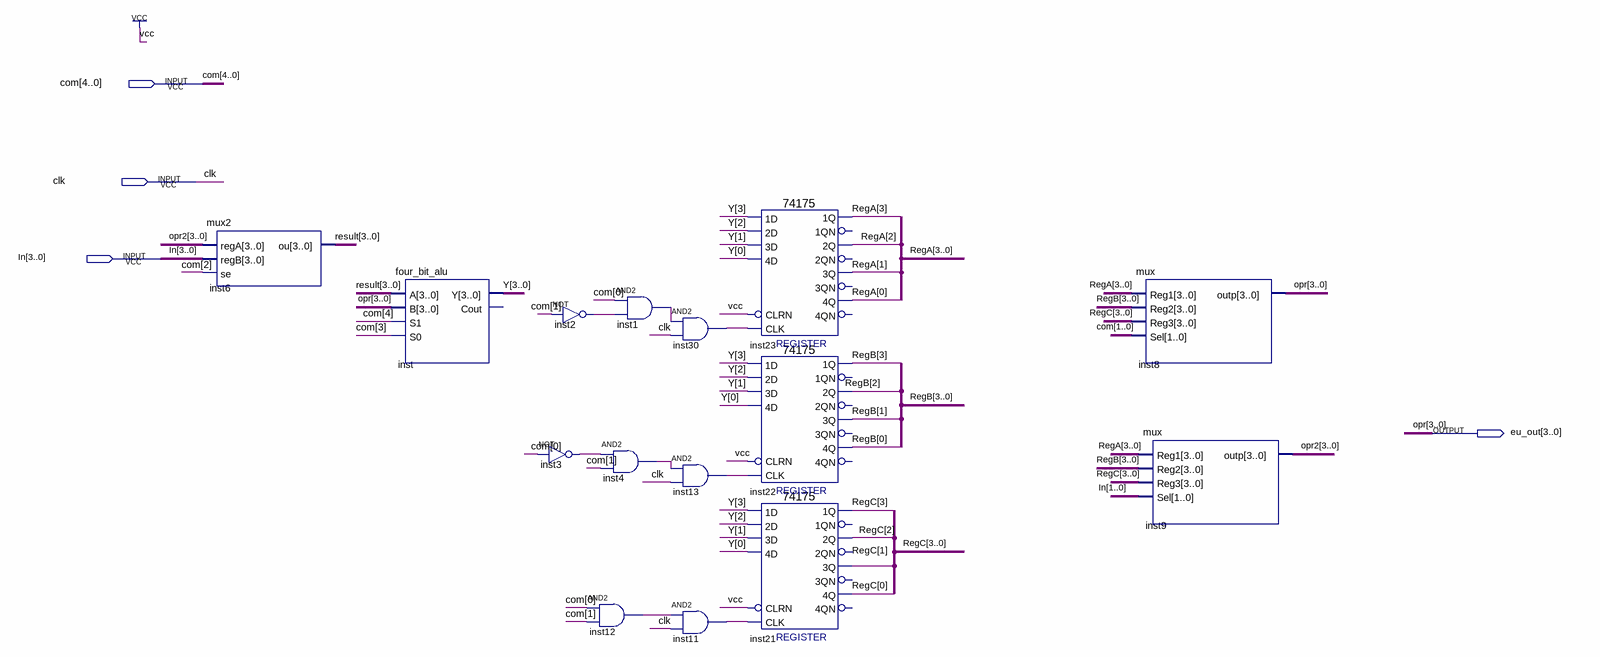
[diagram p0: schematic sheet]
// Quartus schematic EU.bdf as structural Verilog: 15 symbols, 4 pins
module EU (
  input  [4:0] com,
  input  clk,
  input  [3:0] In,
  output [3:0] eu_out
);

  wire inst1_out, inst2_out, inst3_out, inst4_out, inst11_out, inst12_out, inst13_out, inst30_out;
  wire [3:0] opr2, RegA, RegB, RegC, result, Y;

  mux2 inst6 (.regA(opr2), .regB(In), .se(com[2]), .ou(result));
  four_bit_alu inst (.A(result), .B(eu_out), .S1(com[4]), .S0(com[3]), .Y(Y));  // open: Cout
  not inst3 (inst3_out, com[0]);
  not inst2 (inst2_out, com[1]);
  and inst12 (inst12_out, com[0], com[1]);
  and inst1 (inst1_out, com[0], inst2_out);
  and inst4 (inst4_out, inst3_out, com[1]);
  and inst30 (inst30_out, inst1_out, clk);
  and inst13 (inst13_out, inst4_out, clk);
  and inst11 (inst11_out, inst12_out, clk);
  \74175  inst23 (
    .CLRN(1'b1), .CLK(inst30_out), .\3D (Y[1]), .\2D (Y[2]), .\1D (Y[3]), .\4D (Y[0]), .\1Q (RegA[3]),
    .\3Q (RegA[1]), .\2Q (RegA[2]), .\4Q (RegA[0]));  // open: 1QN, 2QN, 4QN, 3QN
  \74175  inst22 (
    .CLRN(1'b1), .CLK(inst13_out), .\3D (Y[1]), .\2D (Y[2]), .\1D (Y[3]), .\4D (Y[0]), .\1Q (RegB[3]),
    .\3Q (RegB[1]), .\2Q (RegB[2]), .\4Q (RegB[0]));  // open: 1QN, 2QN, 4QN, 3QN
  \74175  inst21 (
    .CLRN(1'b1), .CLK(inst11_out), .\3D (Y[1]), .\2D (Y[2]), .\1D (Y[3]), .\4D (Y[0]), .\1Q (RegC[3]),
    .\3Q (RegC[1]), .\2Q (RegC[2]), .\4Q (RegC[0]));  // open: 1QN, 2QN, 4QN, 3QN
  mux inst8 (.Reg1(RegA), .Reg2(RegB), .Reg3(RegC), .Sel(com[1:0]), .outp(eu_out));
  mux inst9 (.Reg1(RegA), .Reg2(RegB), .Reg3(RegC), .Sel(In[1:0]), .outp(opr2));

  // Other names for the same wires on the sheet: opr[3:0] = eu_out
endmodule
